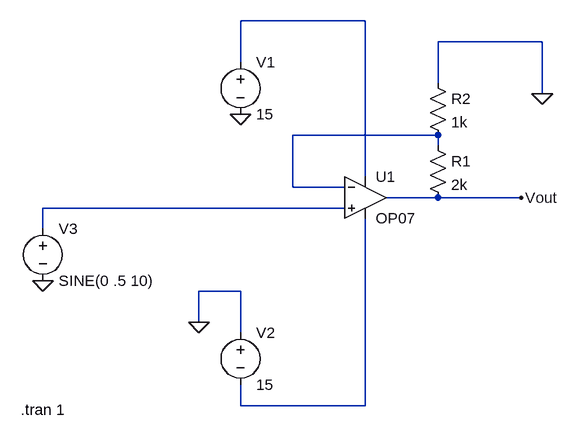
[diagram p0: schematic Noninverting_Amplifier.asc]
Noninverting_Amplifier.asc, the LTspice schematic file:
Version 4
SHEET 1 880 680
WIRE 240 -144 48 -144
WIRE 512 -112 352 -112
WIRE 48 -80 48 -144
WIRE 352 -48 352 -112
WIRE 512 -32 512 -112
WIRE 352 32 128 32
WIRE 352 48 352 32
WIRE 240 96 240 -144
WIRE 128 112 128 32
WIRE 208 112 128 112
WIRE 352 128 272 128
WIRE 480 128 352 128
WIRE 208 144 -256 144
WIRE -256 176 -256 144
WIRE 48 272 -16 272
WIRE -16 320 -16 272
WIRE 48 336 48 272
WIRE 48 448 48 416
WIRE 240 448 240 160
WIRE 240 448 48 448
FLAG -256 256 0
FLAG 512 -32 0
FLAG 48 0 0
FLAG -16 320 0
FLAG 480 128 Vout
SYMBOL OpAmps\\OP07 240 64 R0
SYMATTR InstName U1
SYMBOL voltage 48 -96 R0
WINDOW 123 0 0 Left 0
WINDOW 39 0 0 Left 0
SYMATTR InstName V1
SYMATTR Value 15
SYMBOL voltage 48 320 R0
WINDOW 123 0 0 Left 0
WINDOW 39 0 0 Left 0
SYMATTR InstName V2
SYMATTR Value 15
SYMBOL voltage -256 160 R0
WINDOW 123 0 0 Left 0
WINDOW 39 0 0 Left 0
SYMATTR InstName V3
SYMATTR Value SINE(0 .5 10)
SYMBOL res 336 32 R0
SYMATTR InstName R1
SYMATTR Value 2k
SYMBOL res 336 -64 R0
SYMATTR InstName R2
SYMATTR Value 1k
TEXT -290 454 Left 2 !.tran 1

The netlist it stands for:
* Noninverting_Amplifier.asc
XU1 N003 N002 N001 N004 Vout LT1001  ; OP07, pins In+ In- V+ V- OUT
V1 N001 0 15
V2 0 N004 15
V3 N003 0 SINE(0 .5 10)
R1 N002 Vout 2k
R2 0 N002 1k
.tran 1
.lib LTC.lib
.backanno
.end